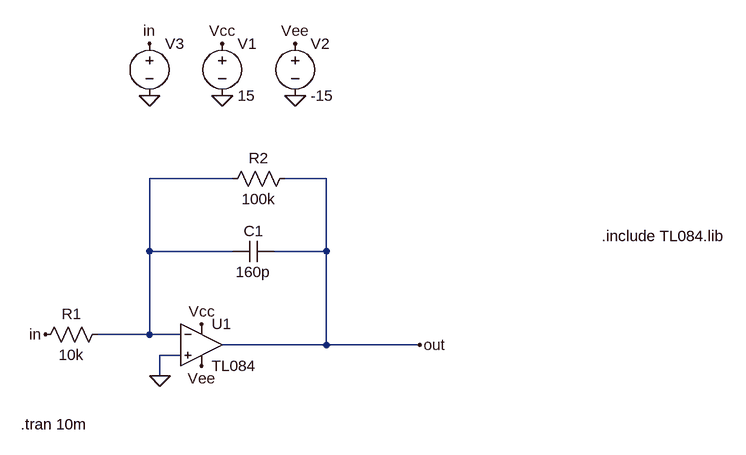
[diagram p0: schematic integrator.asc]
integrator.asc, the LTspice schematic file:
Version 4
SHEET 1 1128 680
WIRE 224 -48 96 -48
WIRE 368 -48 304 -48
WIRE 96 64 96 -48
WIRE 224 64 96 64
WIRE 368 64 368 -48
WIRE 368 64 288 64
WIRE 96 192 96 64
WIRE 96 192 16 192
WIRE 144 192 96 192
WIRE 368 208 368 64
WIRE 368 208 208 208
WIRE 512 208 368 208
WIRE 144 224 112 224
WIRE 112 256 112 224
FLAG 208 -176 0
FLAG 320 -176 0
FLAG 208 -256 Vcc
FLAG 320 -256 Vee
FLAG 96 -176 0
FLAG 176 176 Vcc
FLAG 176 240 Vee
FLAG 96 -256 in
FLAG 112 256 0
FLAG -64 192 in
FLAG 512 208 out
SYMBOL Opamps\\opamp2 176 144 R0
SYMATTR InstName U1
SYMATTR Value TL084
SYMBOL voltage 208 -272 R0
WINDOW 123 0 0 Left 0
WINDOW 39 0 0 Left 0
SYMATTR InstName V1
SYMATTR Value 15
SYMBOL voltage 320 -272 R0
WINDOW 123 0 0 Left 0
WINDOW 39 0 0 Left 0
SYMATTR InstName V2
SYMATTR Value -15
SYMBOL voltage 96 -272 R0
WINDOW 3 24 96 Invisible 2
WINDOW 123 0 0 Left 0
WINDOW 39 0 0 Left 0
SYMATTR Value SINE(0 1 95k)
SYMATTR InstName V3
SYMBOL res 32 176 R90
WINDOW 0 0 56 VBottom 2
WINDOW 3 32 56 VTop 2
SYMATTR InstName R1
SYMATTR Value 10k
SYMBOL cap 288 48 R90
WINDOW 0 0 32 VBottom 2
WINDOW 3 32 32 VTop 2
SYMATTR InstName C1
SYMATTR Value 160p
SYMBOL res 320 -64 R90
WINDOW 0 0 56 VBottom 2
WINDOW 3 32 56 VTop 2
SYMATTR InstName R2
SYMATTR Value 100k
TEXT 792 40 Left 2 !.include TL084.lib
TEXT -102 330 Left 2 !.tran 10m

The netlist it stands for:
* integrator.asc
XU1 0 N001 Vcc Vee out TL084  ; pins In+ In- V+ V- OUT
V1 Vcc 0 15
V2 Vee 0 -15
V3 in 0 SINE(0 1 95k)
R1 N001 in 10k
C1 out N001 160p
R2 out N001 100k
.include TL084.lib
.tran 10m
.backanno
.end